# Altium schematic sheet 5V_and_3V3.SchDoc: 5V 3A and 3.3V 1A Output
size A4; DocumentNumber: 4; SheetNumber: 4; SheetTotal: 16
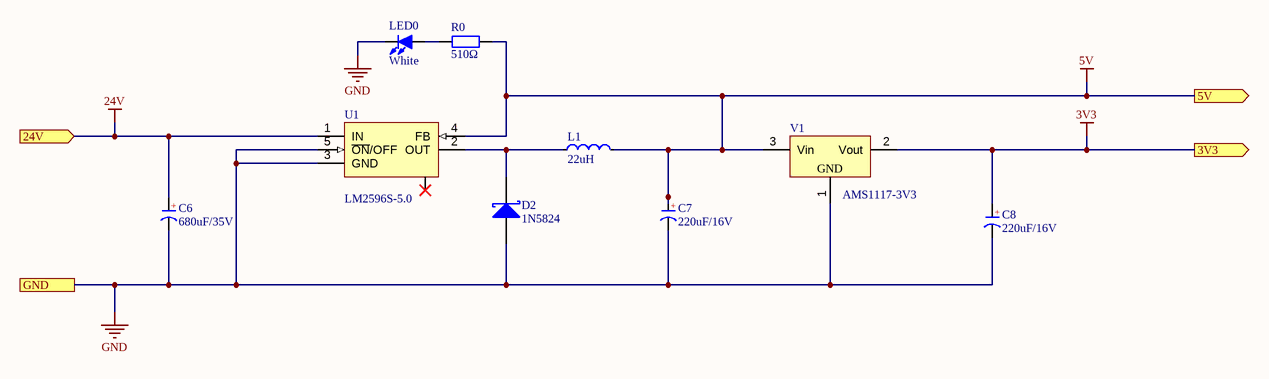
[diagram p0: 5V_and_3V3.SchDoc]

## Parts
C6  680uF/35V  [CM G(12.5*13.5)]
C7  220uF/16V  [CM D(6.3*7.7)]
C8  220uF/16V  [CM D(6.3*7.7)]
D2  1N5824  [SMA]
L1  Inductance: 22uH  [SMD-11.5x10.5]  (hidden comment: InductanceSMD)
LED0  White  [LED 0603W]
R0  510Ω  [R 0603_L]
U1  LM2596S-5.0  [TO263-5A]
V1  AMS1117-3V3  [SOT223_L]

## Ports
3V3 (out), 5V (out), 24V (in), GND

## Nets
3V3: C8.1(A) V1.2(Vout) ; port 3V3
5V: C7.1(A) L1.2 R0.1 U1.4(FB) V1.3(Vin) ; port 5V
24V: C6.1(A) U1.1(IN) ; port 24V
GND: C6.2(K) C7.2(K) C8.2(K) D2.1(A) LED0.2(K) U1.3(GND) U1.5(~{ON}/OFF) V1.1(GND) ; port GND
NetD2_2: D2.2(K) L1.1 U1.2(OUT)
NetLED0_1: LED0.1(A) R0.2

Not connected (* = marked no-connect by the designer): U1 6*

## Notes on the sheet
- Title
- FileName:
- Version:
- Date:
- Project
- Designed By:
- Descriptions:
- Sheet:
- of
- (in symbol CE_SMD) +

## Library data of the parts
C6 = CE_SMD: 贴片电解电容; 版权归属: 封装库来自淘宝 ID：黄晶宝石; BOM名称: 贴片电解电容; 联系售后: https://shop463601444.taobao.com
C7 C8 = CE_SMD: 贴片电解电容 C4054381; 版权归属: 封装库来自淘宝 ID：黄晶宝石; BOM名称: 贴片电解电容; 联系售后: https://shop463601444.taobao.com
D2 = SS14: 肖特基二极管; 属性: 40V/1A; BOM名称: 肖特基二极管; 封装库来自淘宝 ID：黄晶宝石: https://shop463601444.taobao.com
L1 = InductanceSMD: C280568 / (MHCC10040-330M-R7)
LED0 = LED-SMD: 贴片LED; 版权归属: 封装库来自淘宝 ID：黄晶宝石; BOM名称: 贴片LED; 学习资源: https://shop463601444.taobao.com
R0 = R: 贴片电阻; 版权归属: 来自淘宝 ID：黄晶宝石; 封装库来自淘宝卖家 ID：黄晶宝石: 其他店铺购入均为盗版，不享受售后技术支持服务，请立即申请退款; BOM名称: 贴片电阻; 联系售后: https://shop463601444.taobao.com
U1 = LM2596S-5.0: 5V稳压芯片; Note: Tab is connected to GND; Published: 15-Apr-2002; DatasheetVersion: Dec-1997; PackageReference: TS5B; Publisher: Altium Limited; PackageDescription: D2-PAK; 5 Leads; Body 14.4 (inc. leads) x 10.4 mm (LxW max); ComponentLink1Description: Manufacturer Link; ComponentLink1URL: http://www.national.com/; ComponentLink2Description: Datasheet; ComponentLink2URL: http://www.national.com/ds.cgi/LM/LM2596.pdf; ComponentLink3Description: URL Link1; ComponentLink3URL: http://www.national.com/pf/LM/LM2596.html
V1 = AMS1117: 三端稳压芯片; BOM名称: 稳压芯片; 淘宝ID: 封装库来自淘宝 ID：黄晶宝石; 欢迎光临淘宝店铺: https://shop463601444.taobao.com